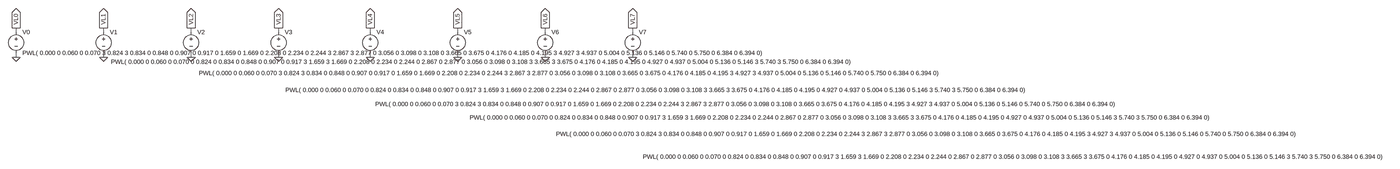
[diagram p0: schematic OutputLabels.asc, whole sheet]
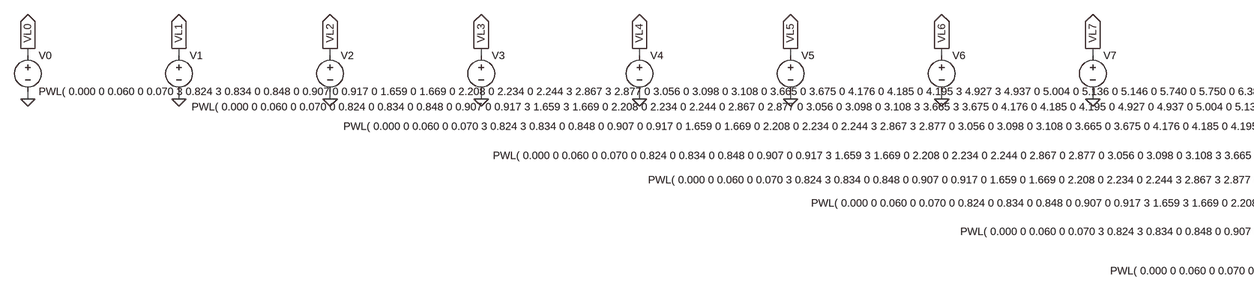
[diagram p1: schematic OutputLabels.asc, part, row 1 of 1, column 1 of 2]
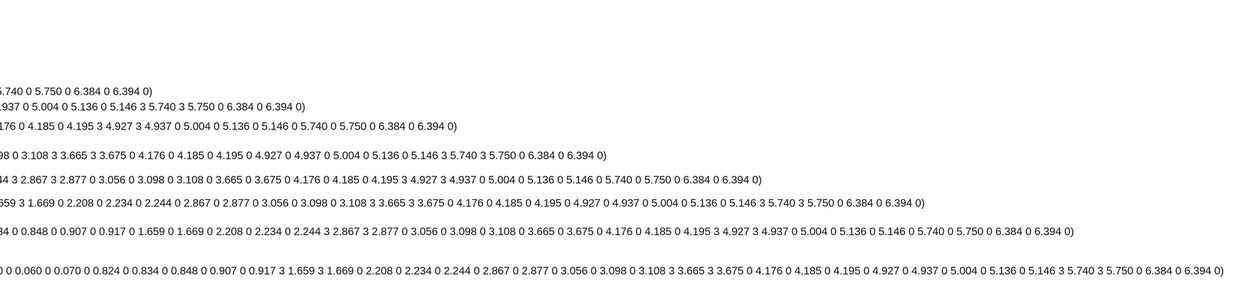
[diagram p2: schematic OutputLabels.asc, part, row 1 of 1, column 2 of 2]
OutputLabels.asc, the LTspice schematic file:
Version 4
SHEET 1 2720 680
WIRE 64 64 64 48
WIRE 400 64 400 48
WIRE 736 64 736 48
WIRE 1072 64 1072 48
WIRE 1424 64 1424 48
WIRE 1760 64 1760 48
WIRE 2096 64 2096 48
WIRE 2432 64 2432 48
WIRE 64 160 64 144
WIRE 400 160 400 144
WIRE 736 160 736 144
WIRE 1072 160 1072 144
WIRE 1424 160 1424 144
WIRE 1760 160 1760 144
WIRE 2096 160 2096 144
WIRE 2432 160 2432 144
FLAG 64 48 VL0
IOPIN 64 48 Out
FLAG 64 160 0
FLAG 400 48 VL1
IOPIN 400 48 Out
FLAG 400 160 0
FLAG 736 48 VL2
IOPIN 736 48 Out
FLAG 736 160 0
FLAG 1072 48 VL3
IOPIN 1072 48 Out
FLAG 1072 160 0
FLAG 1424 48 VL4
IOPIN 1424 48 Out
FLAG 1424 160 0
FLAG 1760 48 VL5
IOPIN 1760 48 Out
FLAG 1760 160 0
FLAG 2096 48 VL6
IOPIN 2096 48 Out
FLAG 2096 160 0
FLAG 2432 48 VL7
IOPIN 2432 48 Out
FLAG 2432 160 0
SYMBOL voltage 64 48 R0
WINDOW 123 0 0 Left 2
WINDOW 39 0 0 Left 2
SYMATTR InstName V0
SYMATTR Value PWL( 0.000 0 0.060 0 0.070 3 0.824 3 0.834 0 0.848 0 0.907 0 0.917 0 1.659 0 1.669 0 2.208 0 2.234 0 2.244 3 2.867 3 2.877 0 3.056 0 3.098 0 3.108 0 3.665 0 3.675 0 4.176 0 4.185 0 4.195 3 4.927 3 4.937 0 5.004 0 5.136 0 5.146 0 5.740 0 5.750 0 6.384 0 6.394 0)
SYMBOL voltage 400 48 R0
WINDOW 123 0 0 Left 2
WINDOW 39 0 0 Left 2
WINDOW 3 28 130 Left 2
SYMATTR InstName V1
SYMATTR Value PWL( 0.000 0 0.060 0 0.070 0 0.824 0 0.834 0 0.848 0 0.907 0 0.917 3 1.659 3 1.669 0 2.208 0 2.234 0 2.244 0 2.867 0 2.877 0 3.056 0 3.098 0 3.108 3 3.665 3 3.675 0 4.176 0 4.185 0 4.195 0 4.927 0 4.937 0 5.004 0 5.136 0 5.146 3 5.740 3 5.750 0 6.384 0 6.394 0)
SYMBOL voltage 736 48 R0
WINDOW 123 0 0 Left 2
WINDOW 39 0 0 Left 2
WINDOW 3 30 173 Left 2
SYMATTR InstName V2
SYMATTR Value PWL( 0.000 0 0.060 0 0.070 3 0.824 3 0.834 0 0.848 0 0.907 0 0.917 0 1.659 0 1.669 0 2.208 0 2.234 0 2.244 3 2.867 3 2.877 0 3.056 0 3.098 0 3.108 0 3.665 0 3.675 0 4.176 0 4.185 0 4.195 3 4.927 3 4.937 0 5.004 0 5.136 0 5.146 0 5.740 0 5.750 0 6.384 0 6.394 0)
SYMBOL voltage 1072 48 R0
WINDOW 123 0 0 Left 2
WINDOW 39 0 0 Left 2
WINDOW 3 26 238 Left 2
SYMATTR InstName V3
SYMATTR Value PWL( 0.000 0 0.060 0 0.070 0 0.824 0 0.834 0 0.848 0 0.907 0 0.917 3 1.659 3 1.669 0 2.208 0 2.234 0 2.244 0 2.867 0 2.877 0 3.056 0 3.098 0 3.108 3 3.665 3 3.675 0 4.176 0 4.185 0 4.195 0 4.927 0 4.937 0 5.004 0 5.136 0 5.146 3 5.740 3 5.750 0 6.384 0 6.394 0)
SYMBOL voltage 1424 48 R0
WINDOW 123 0 0 Left 2
WINDOW 39 0 0 Left 2
WINDOW 3 19 292 Left 2
SYMATTR InstName V4
SYMATTR Value PWL( 0.000 0 0.060 0 0.070 3 0.824 3 0.834 0 0.848 0 0.907 0 0.917 0 1.659 0 1.669 0 2.208 0 2.234 0 2.244 3 2.867 3 2.877 0 3.056 0 3.098 0 3.108 0 3.665 0 3.675 0 4.176 0 4.185 0 4.195 3 4.927 3 4.937 0 5.004 0 5.136 0 5.146 0 5.740 0 5.750 0 6.384 0 6.394 0)
SYMBOL voltage 1760 48 R0
WINDOW 123 0 0 Left 2
WINDOW 39 0 0 Left 2
WINDOW 3 46 344 Left 2
SYMATTR InstName V5
SYMATTR Value PWL( 0.000 0 0.060 0 0.070 0 0.824 0 0.834 0 0.848 0 0.907 0 0.917 3 1.659 3 1.669 0 2.208 0 2.234 0 2.244 0 2.867 0 2.877 0 3.056 0 3.098 0 3.108 3 3.665 3 3.675 0 4.176 0 4.185 0 4.195 0 4.927 0 4.937 0 5.004 0 5.136 0 5.146 3 5.740 3 5.750 0 6.384 0 6.394 0)
SYMBOL voltage 2096 48 R0
WINDOW 123 0 0 Left 2
WINDOW 39 0 0 Left 2
WINDOW 3 41 407 Left 2
SYMATTR InstName V6
SYMATTR Value PWL( 0.000 0 0.060 0 0.070 3 0.824 3 0.834 0 0.848 0 0.907 0 0.917 0 1.659 0 1.669 0 2.208 0 2.234 0 2.244 3 2.867 3 2.877 0 3.056 0 3.098 0 3.108 0 3.665 0 3.675 0 4.176 0 4.185 0 4.195 3 4.927 3 4.937 0 5.004 0 5.136 0 5.146 0 5.740 0 5.750 0 6.384 0 6.394 0)
SYMBOL voltage 2432 48 R0
WINDOW 123 0 0 Left 2
WINDOW 39 0 0 Left 2
WINDOW 3 39 495 Left 2
SYMATTR InstName V7
SYMATTR Value PWL( 0.000 0 0.060 0 0.070 0 0.824 0 0.834 0 0.848 0 0.907 0 0.917 3 1.659 3 1.669 0 2.208 0 2.234 0 2.244 0 2.867 0 2.877 0 3.056 0 3.098 0 3.108 3 3.665 3 3.675 0 4.176 0 4.185 0 4.195 0 4.927 0 4.937 0 5.004 0 5.136 0 5.146 3 5.740 3 5.750 0 6.384 0 6.394 0)

The netlist it stands for:
* OutputLabels.asc
V0 VL0 0 PWL( 0.000 0 0.060 0 0.070 3 0.824 3 0.834 0 0.848 0 0.907 0 0.917 0 1.659 0 1.669 0 2.208 0 2.234 0 2.244 3 2.867 3 2.877 0 3.056 0 3.098 0 3.108 0 3.665 0 3.675 0 4.176 0 4.185 0 4.195 3 4.927 3 4.937 0 5.004 0 5.136 0 5.146 0 5.740 0 5.750 0 6.384 0 6.394 0)
V1 VL1 0 PWL( 0.000 0 0.060 0 0.070 0 0.824 0 0.834 0 0.848 0 0.907 0 0.917 3 1.659 3 1.669 0 2.208 0 2.234 0 2.244 0 2.867 0 2.877 0 3.056 0 3.098 0 3.108 3 3.665 3 3.675 0 4.176 0 4.185 0 4.195 0 4.927 0 4.937 0 5.004 0 5.136 0 5.146 3 5.740 3 5.750 0 6.384 0 6.394 0)
V2 VL2 0 PWL( 0.000 0 0.060 0 0.070 3 0.824 3 0.834 0 0.848 0 0.907 0 0.917 0 1.659 0 1.669 0 2.208 0 2.234 0 2.244 3 2.867 3 2.877 0 3.056 0 3.098 0 3.108 0 3.665 0 3.675 0 4.176 0 4.185 0 4.195 3 4.927 3 4.937 0 5.004 0 5.136 0 5.146 0 5.740 0 5.750 0 6.384 0 6.394 0)
V3 VL3 0 PWL( 0.000 0 0.060 0 0.070 0 0.824 0 0.834 0 0.848 0 0.907 0 0.917 3 1.659 3 1.669 0 2.208 0 2.234 0 2.244 0 2.867 0 2.877 0 3.056 0 3.098 0 3.108 3 3.665 3 3.675 0 4.176 0 4.185 0 4.195 0 4.927 0 4.937 0 5.004 0 5.136 0 5.146 3 5.740 3 5.750 0 6.384 0 6.394 0)
V4 VL4 0 PWL( 0.000 0 0.060 0 0.070 3 0.824 3 0.834 0 0.848 0 0.907 0 0.917 0 1.659 0 1.669 0 2.208 0 2.234 0 2.244 3 2.867 3 2.877 0 3.056 0 3.098 0 3.108 0 3.665 0 3.675 0 4.176 0 4.185 0 4.195 3 4.927 3 4.937 0 5.004 0 5.136 0 5.146 0 5.740 0 5.750 0 6.384 0 6.394 0)
V5 VL5 0 PWL( 0.000 0 0.060 0 0.070 0 0.824 0 0.834 0 0.848 0 0.907 0 0.917 3 1.659 3 1.669 0 2.208 0 2.234 0 2.244 0 2.867 0 2.877 0 3.056 0 3.098 0 3.108 3 3.665 3 3.675 0 4.176 0 4.185 0 4.195 0 4.927 0 4.937 0 5.004 0 5.136 0 5.146 3 5.740 3 5.750 0 6.384 0 6.394 0)
V6 VL6 0 PWL( 0.000 0 0.060 0 0.070 3 0.824 3 0.834 0 0.848 0 0.907 0 0.917 0 1.659 0 1.669 0 2.208 0 2.234 0 2.244 3 2.867 3 2.877 0 3.056 0 3.098 0 3.108 0 3.665 0 3.675 0 4.176 0 4.185 0 4.195 3 4.927 3 4.937 0 5.004 0 5.136 0 5.146 0 5.740 0 5.750 0 6.384 0 6.394 0)
V7 VL7 0 PWL( 0.000 0 0.060 0 0.070 0 0.824 0 0.834 0 0.848 0 0.907 0 0.917 3 1.659 3 1.669 0 2.208 0 2.234 0 2.244 0 2.867 0 2.877 0 3.056 0 3.098 0 3.108 3 3.665 3 3.675 0 4.176 0 4.185 0 4.195 0 4.927 0 4.937 0 5.004 0 5.136 0 5.146 3 5.740 3 5.750 0 6.384 0 6.394 0)
.backanno
.end